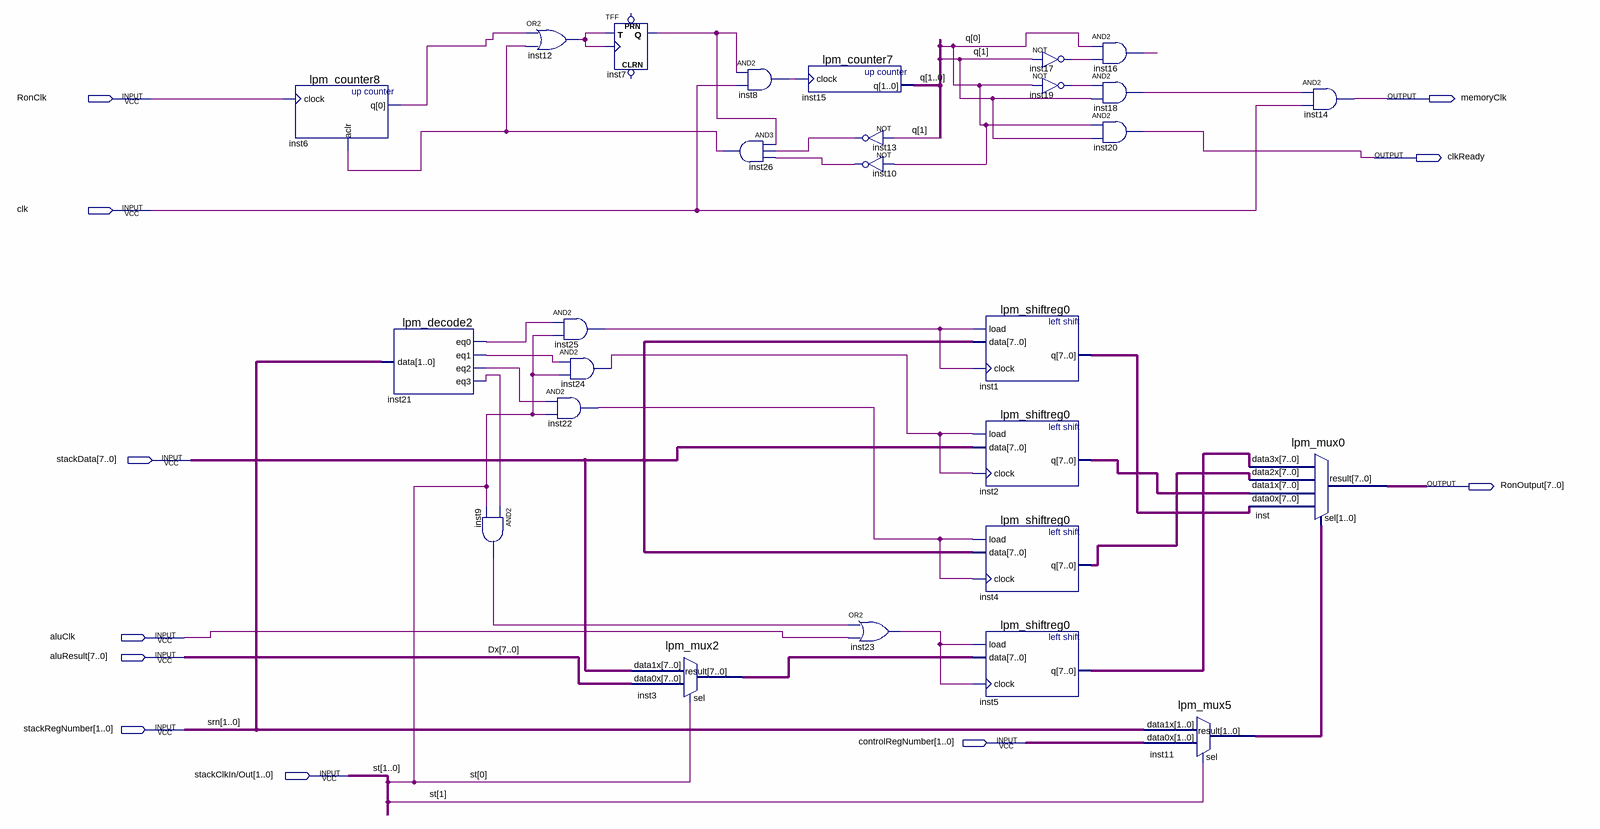
[diagram p0: schematic sheet]
// Quartus schematic Ron.bdf as structural Verilog: 27 symbols, 11 pins
module Ron (
  input  RonClk,
  input  clk,
  input  [7:0] stackData,
  input  aluClk,
  input  [7:0] aluResult,
  input  [1:0] stackRegNumber,
  input  [1:0] controlRegNumber,
  input  [1:0] \stackClkIn/Out ,
  output memoryClk,
  output clkReady,
  output [7:0] RonOutput
);

  wire inst6_q, inst7_q, inst8_out, inst9_out, inst10_out, inst12_out, inst13_out, inst16_out, inst17_out,
       inst18_out, inst19_out, inst21_eq0, inst21_eq1, inst21_eq2, inst21_eq3, inst22_out, inst23_out,
       inst24_out, inst25_out, inst26_out;
  wire [1:0] inst11_result, q;
  wire [7:0] inst1_q, inst2_q, inst3_result, inst4_q, inst5_q;

  lpm_counter8 inst6 (.clock(RonClk), .aclr(inst26_out), .q(inst6_q));
  lpm_decode2 inst21 (.data(stackRegNumber), .eq0(inst21_eq0), .eq1(inst21_eq1), .eq2(inst21_eq2), .eq3(inst21_eq3));
  and inst9 (inst9_out, inst21_eq3, \stackClkIn/Out [0]);
  or inst12 (inst12_out, inst6_q, inst26_out);
  and inst25 (inst25_out, inst21_eq0, \stackClkIn/Out [0]);
  and inst24 (inst24_out, inst21_eq1, \stackClkIn/Out [0]);
  and inst22 (inst22_out, inst21_eq2, \stackClkIn/Out [0]);
  TFF inst7 (.T(inst12_out), .CLK(inst12_out), .Q(inst7_q));  // open: PRN, CLRN
  lpm_mux2 inst3 (.data1x(stackData), .data0x(aluResult), .sel(\stackClkIn/Out [0]), .result(inst3_result));
  and inst8 (inst8_out, inst7_q, clk);
  and inst26 (inst26_out, inst7_q, inst13_out, inst10_out);
  lpm_counter7 inst15 (.clock(inst8_out), .q(q));
  not inst13 (inst13_out, q[1]);
  not inst10 (inst10_out, q[0]);
  or inst23 (inst23_out, inst9_out, aluClk);
  lpm_shiftreg0 inst1 (.load(inst25_out), .data(stackData), .clock(inst25_out), .q(inst1_q));
  lpm_shiftreg0 inst2 (.load(inst24_out), .data(stackData), .clock(inst24_out), .q(inst2_q));
  lpm_shiftreg0 inst4 (.load(inst22_out), .data(stackData), .clock(inst22_out), .q(inst4_q));
  lpm_shiftreg0 inst5 (.load(inst23_out), .data(inst3_result), .clock(inst23_out), .q(inst5_q));
  not inst17 (inst17_out, q[1]);
  not inst19 (inst19_out, q[0]);
  and inst16 (inst16_out, q[0], inst17_out);
  and inst18 (inst18_out, inst19_out, q[1]);
  and inst20 (clkReady, q[0], q[1]);
  lpm_mux5 inst11 (
    .data1x(stackRegNumber), .data0x(controlRegNumber), .sel(\stackClkIn/Out [1]), .result(inst11_result));
  lpm_mux0 inst (
    .data3x(inst5_q), .data2x(inst4_q), .data1x(inst2_q), .data0x(inst1_q), .sel(inst11_result),
    .result(RonOutput));
  and inst14 (memoryClk, inst18_out, clk);

  // Other names for the same wires on the sheet: Dx[7:0] = aluResult; srn[1:0] = stackRegNumber;
  //   st[1:0] = \stackClkIn/Out 
endmodule
